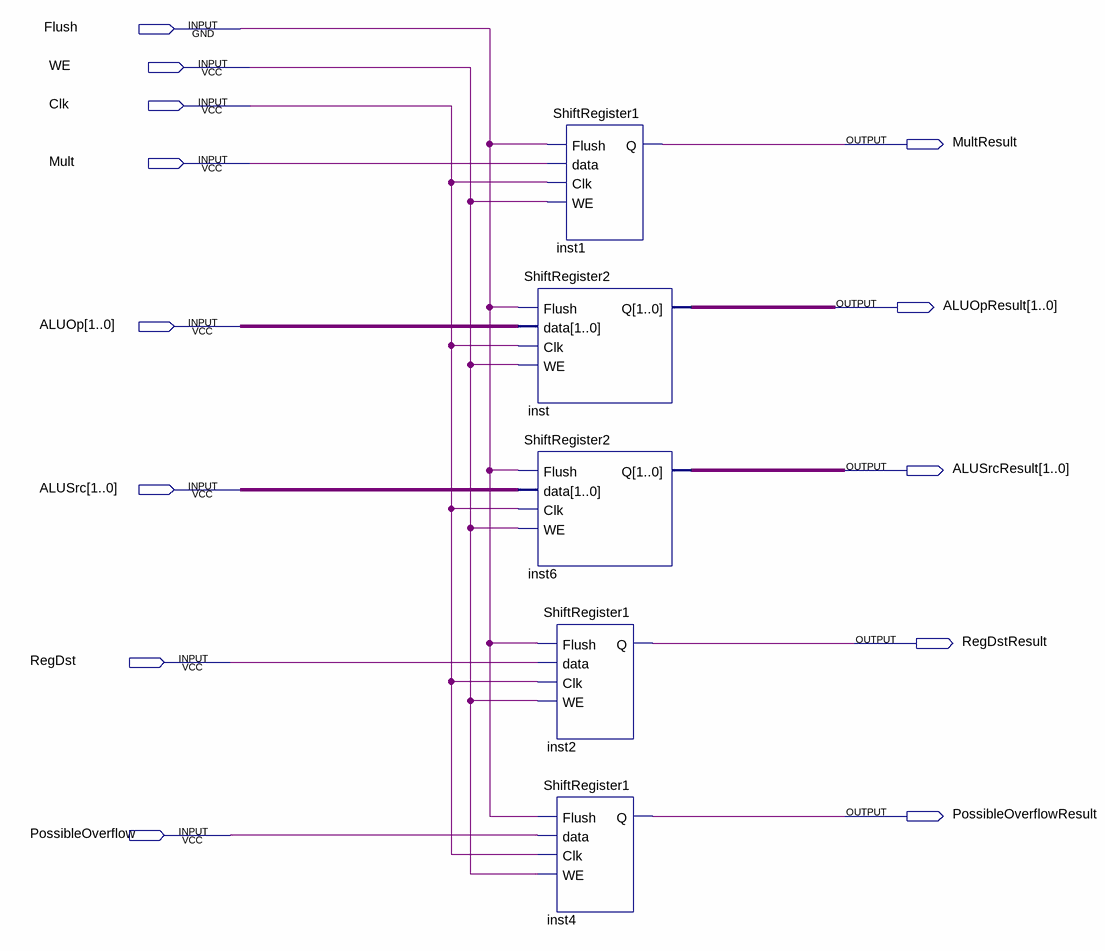
[diagram p0: schematic sheet]
// Quartus schematic EX_Register.bdf as structural Verilog: 5 symbols, 13 pins
module EX_Register (
  input  Flush,
  input  WE,
  input  Clk,
  input  Mult,
  input  [1:0] ALUOp,
  input  [1:0] ALUSrc,
  input  RegDst,
  input  PossibleOverflow,
  output MultResult,
  output [1:0] ALUOpResult,
  output [1:0] ALUSrcResult,
  output RegDstResult,
  output PossibleOverflowResult
);

  ShiftRegister1 inst1 (.Flush(Flush), .data(Mult), .Clk(Clk), .WE(WE), .Q(MultResult));
  ShiftRegister2 inst (.Flush(Flush), .data(ALUOp), .Clk(Clk), .WE(WE), .Q(ALUOpResult));
  ShiftRegister2 inst6 (.Flush(Flush), .data(ALUSrc), .Clk(Clk), .WE(WE), .Q(ALUSrcResult));
  ShiftRegister1 inst2 (.Flush(Flush), .data(RegDst), .Clk(Clk), .WE(WE), .Q(RegDstResult));
  ShiftRegister1 inst4 (.Flush(Flush), .data(PossibleOverflow), .Clk(Clk), .WE(WE), .Q(PossibleOverflowResult));
endmodule
